# Altium schematic sheet 框图.SchDoc
size A3; SheetNumber: 8; SheetTotal: 8
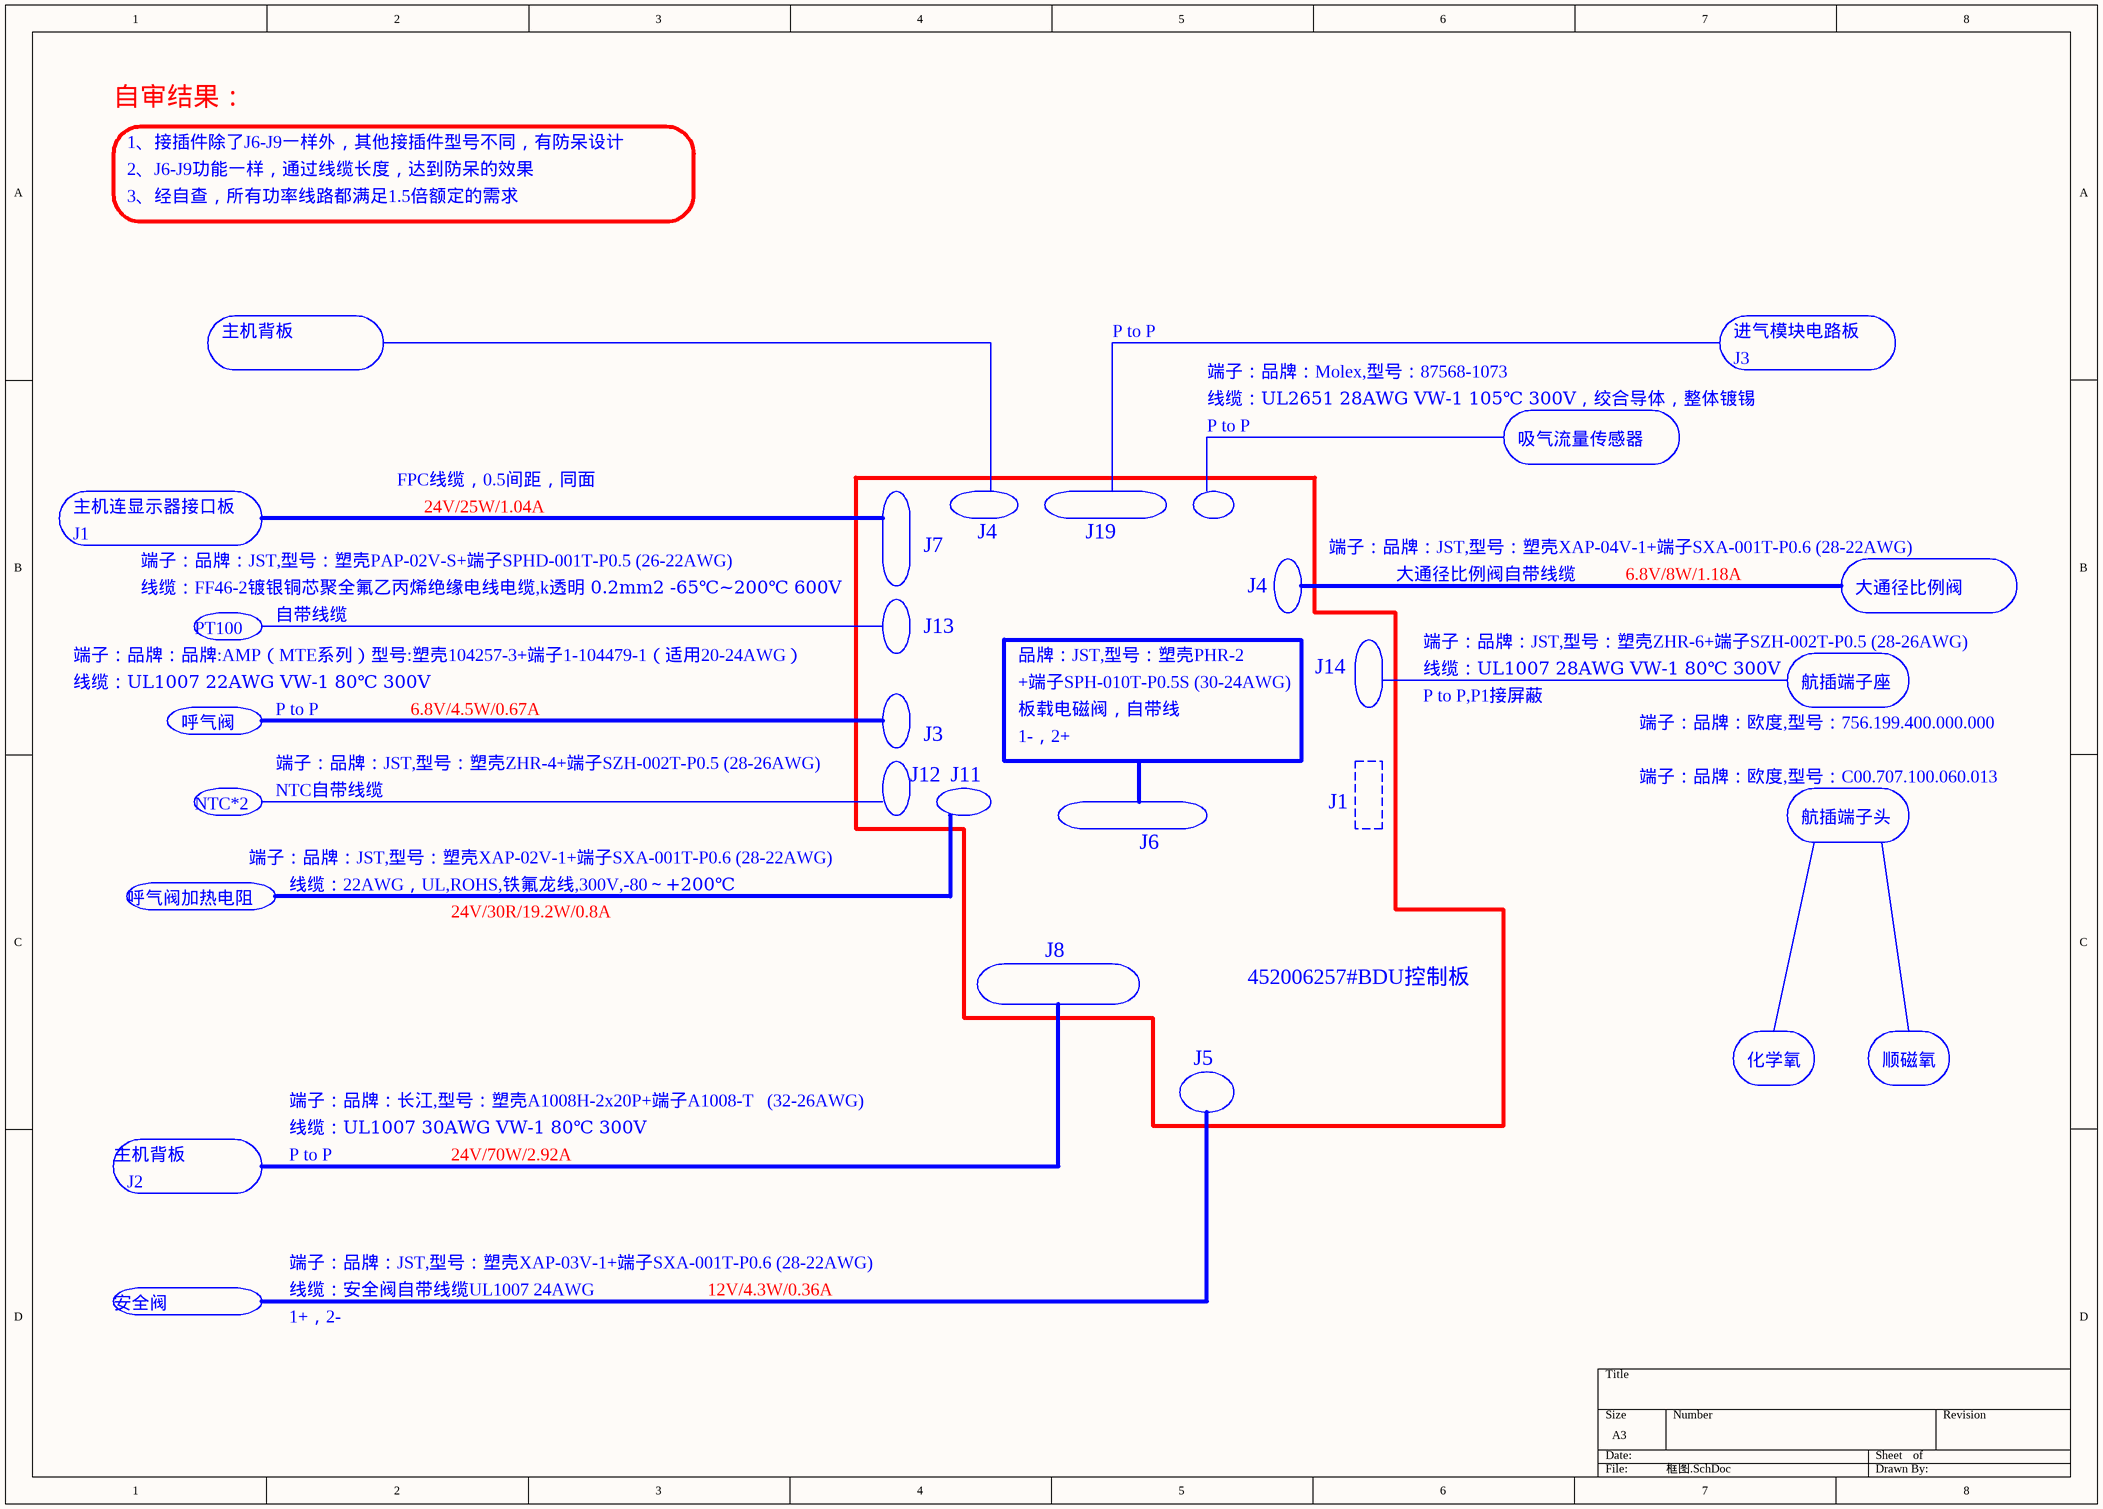
[diagram p0: 框图.SchDoc]

## Notes on the sheet
- 自审结果：
- 1、接插件除了J6-J9一样外，其他接插件型号不同，有防呆设计
- 2、J6-J9功能一样，通过线缆长度，达到防呆的效果
- 3、经自查，所有功率线路都满足1.5倍额定的需求
- 主机背板
- P to P
- 端子：品牌：Molex,型号：87568-1073
- 进气模块电路板
- J3
- 线缆：UL2651 28AWG VW-1 105℃ 300V，绞合导体，整体镀锡
- 吸气流量传感器
- 主机连显示器接口板
- FPC线缆，0.5间距，同面
- 24V/25W/1.04A
- J1
- 端子：品牌：JST,型号：塑壳PAP-02V-S+端子SPHD-001T-P0.5 (26-22AWG)
- J7
- J4
- J19
- 端子：品牌：JST,型号：塑壳XAP-04V-1+端子SXA-001T-P0.6 (28-22AWG)
- 大通径比例阀自带线缆
- 6.8V/8W/1.18A
- 线缆：FF46-2镀银铜芯聚全氟乙丙烯绝缘电线电缆,k透明 0.2mm2 -65℃~200℃ 600V
- PT100
- 自带线缆
- J13
- 端子：品牌：JST,型号：塑壳ZHR-6+端子SZH-002T-P0.5 (28-26AWG)
- 大通径比例阀
- 端子：品牌：品牌:AMP（MTE系列）型号:塑壳104257-3+端子1-104479-1（适用20-24AWG）
- 线缆：UL1007 22AWG VW-1 80℃ 300V
- 6.8V/4.5W/0.67A
- 品牌：JST,型号：塑壳PHR-2
- +端子SPH-010T-P0.5S (30-24AWG)
- 板载电磁阀，自带线
- J14
- 线缆：UL1007 28AWG VW-1 80℃ 300V
- P to P,P1接屏蔽
- 航插端子座
- 呼气阀
- 端子：品牌：JST,型号：塑壳ZHR-4+端子SZH-002T-P0.5 (28-26AWG)
- J12
- J11
- 1-，2+
- 端子：品牌：欧度,型号：756.199.400.000.000
- 端子：品牌：欧度,型号：C00.707.100.060.013
- NTC*2
- NTC自带线缆
- J6
- 航插端子头
- 呼气阀加热电阻
- 端子：品牌：JST,型号：塑壳XAP-02V-1+端子SXA-001T-P0.6 (28-22AWG)
- 线缆：22AWG，UL,ROHS,铁氟龙线,300V,-80～+200℃
- 24V/30R/19.2W/0.8A
- J8
- 452006257#BDU控制板
- 端子：品牌：长江,型号：塑壳A1008H-2x20P+端子A1008-T   (32-26AWG)
- J5
- 化学氧
- 顺磁氧
- J2
- 线缆：UL1007 30AWG VW-1 80℃ 300V
- 24V/70W/2.92A
- 安全阀
- 端子：品牌：JST,型号：塑壳XAP-03V-1+端子SXA-001T-P0.6 (28-22AWG)
- 线缆：安全阀自带线缆UL1007 24AWG
- 1+，2-
- 12V/4.3W/0.36A